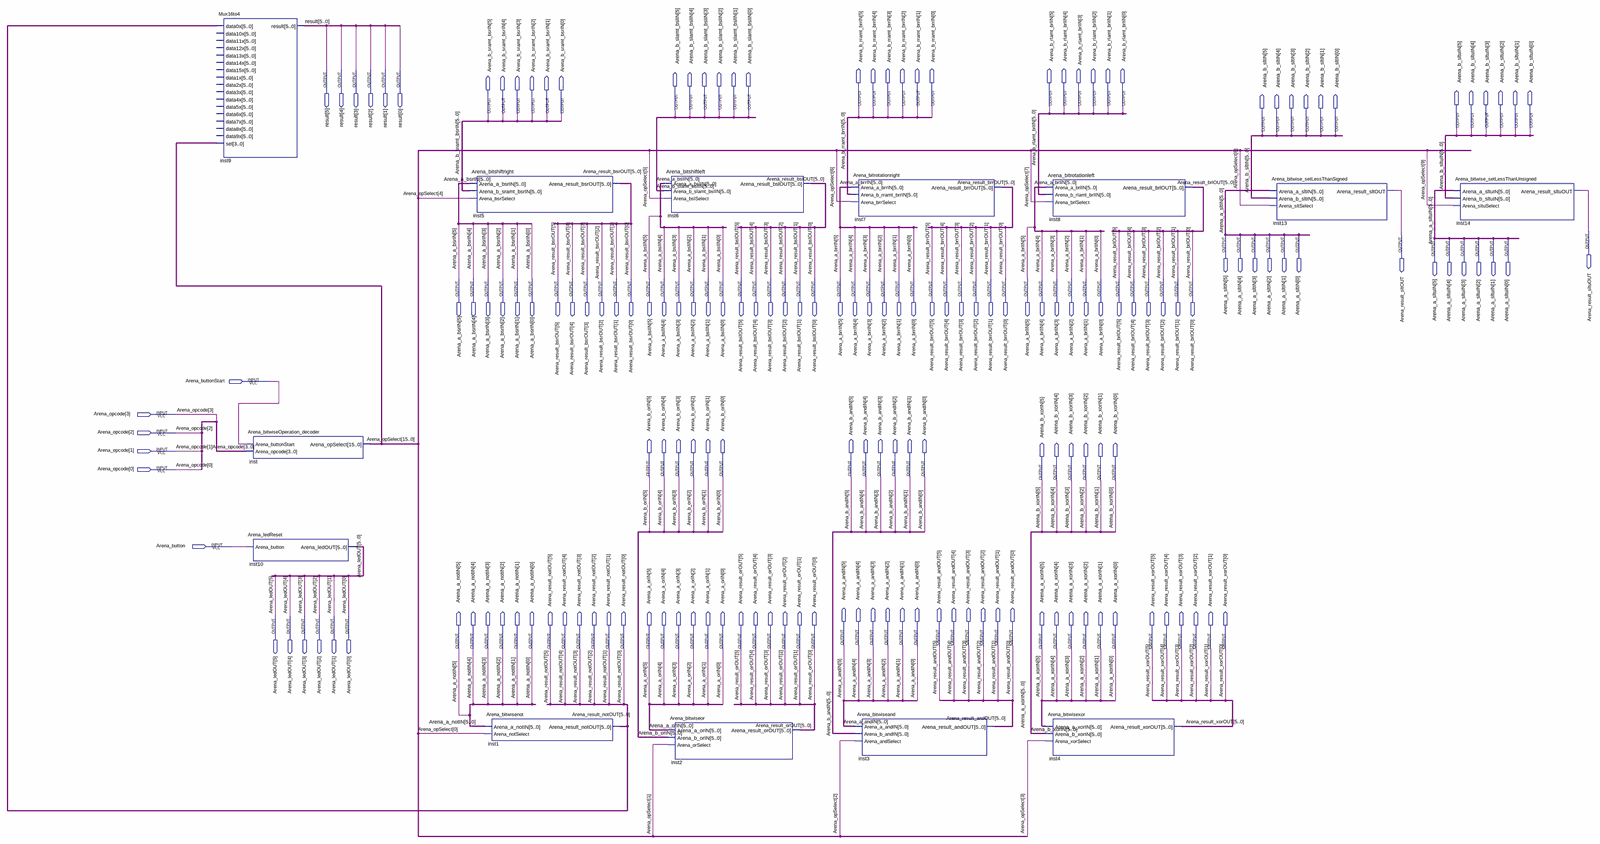
[diagram p0: schematic sheet, whole]
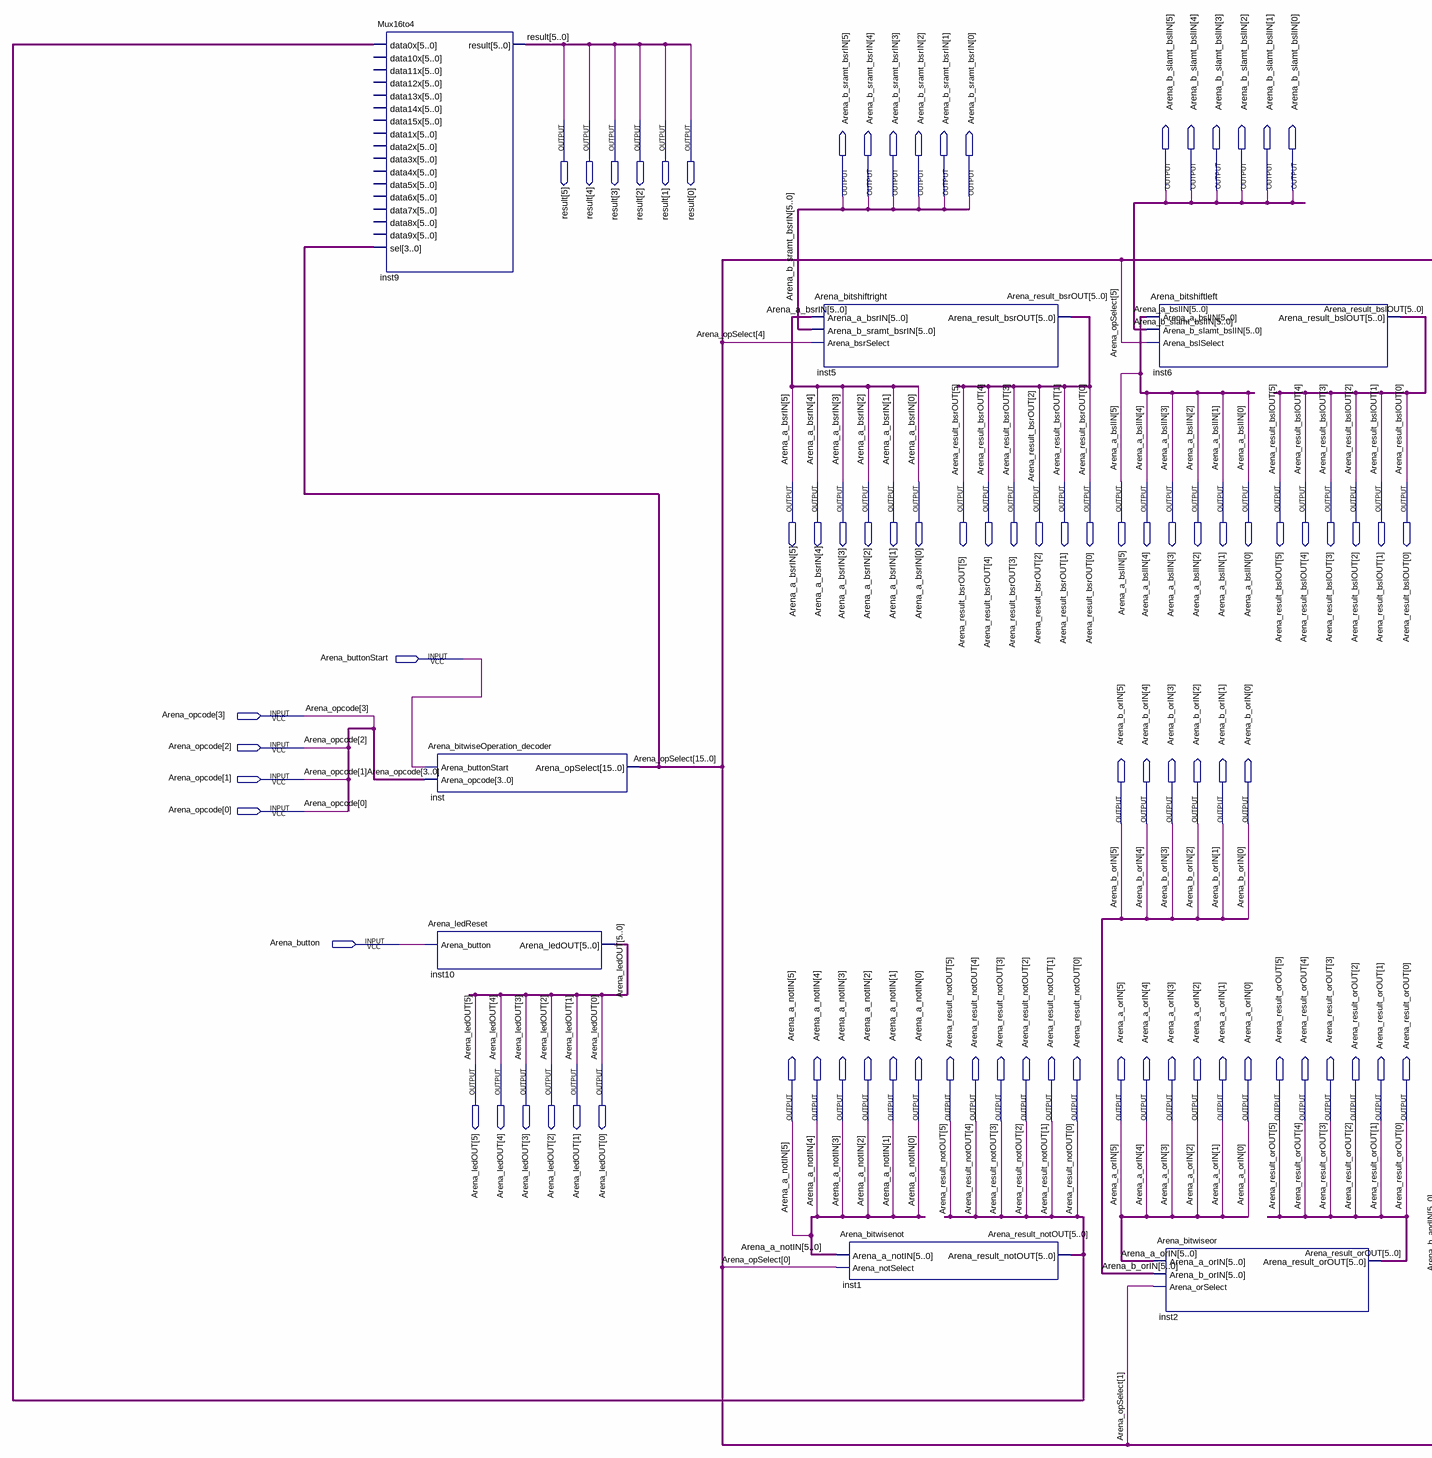
[diagram p1: schematic sheet, left part]
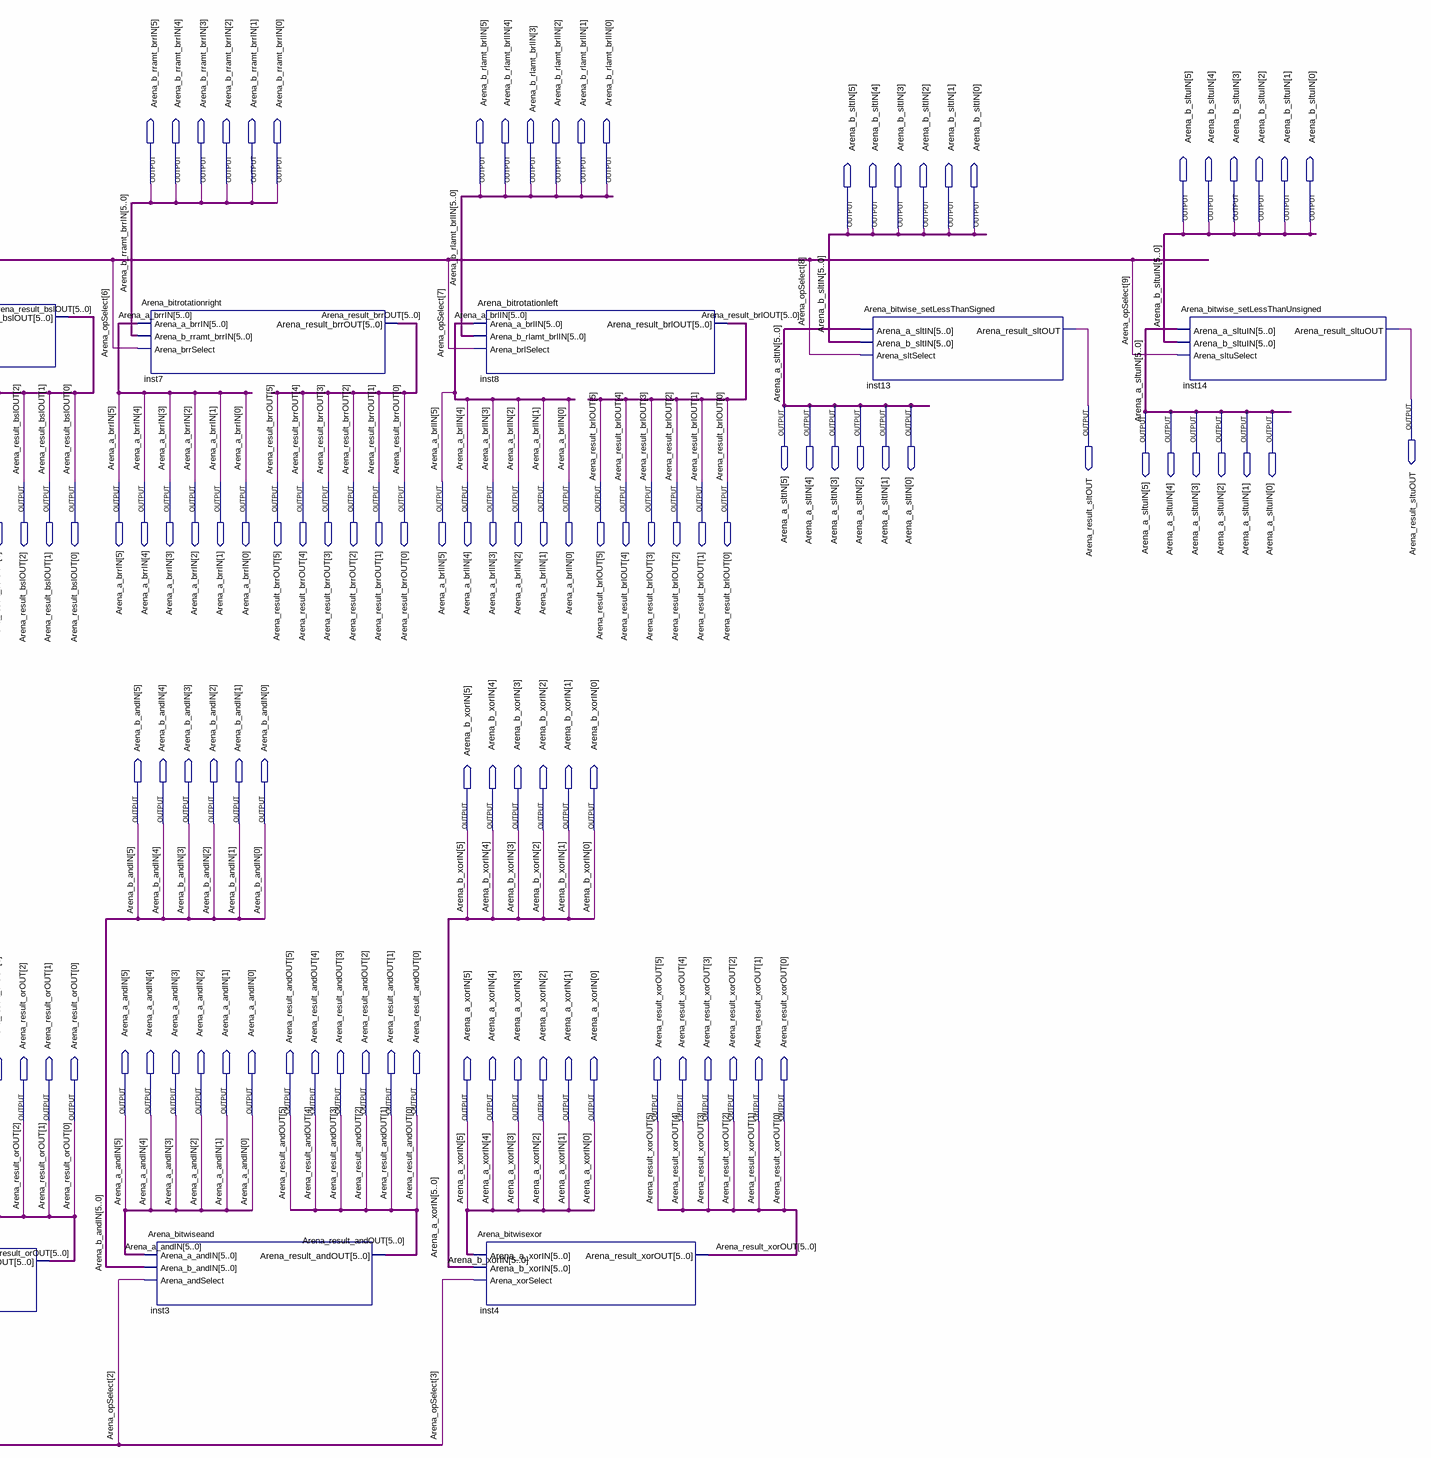
[diagram p2: schematic sheet, right part]
// Quartus schematic Arena_bitwise.bdf as structural Verilog: 13 symbols, 182 pins
module Arena_bitwise (
  input  Arena_buttonStart,
  input  [3:0] Arena_opcode,
  input  Arena_button,
  output [5:0] result,
  output [5:0] Arena_b_rramt_brrIN,
  output [5:0] Arena_b_rlamt_brlIN,
  output [5:0] Arena_b_slamt_bslIN,
  output [5:0] Arena_b_sramt_bsrIN,
  output [5:0] Arena_b_sltuIN,
  output [5:0] Arena_b_sltIN,
  output Arena_result_sltuOUT,
  output [5:0] Arena_a_sltIN,
  output Arena_result_sltOUT,
  output [5:0] Arena_a_sltuIN,
  output [5:0] Arena_a_bsrIN,
  output [5:0] Arena_result_bsrOUT,
  output [5:0] Arena_a_bslIN,
  output [5:0] Arena_result_bslOUT,
  output [5:0] Arena_a_brrIN,
  output [5:0] Arena_result_brrOUT,
  output [5:0] Arena_a_brlIN,
  output [5:0] Arena_result_brlOUT,
  output [5:0] Arena_b_orIN,
  output [5:0] Arena_b_andIN,
  output [5:0] Arena_b_xorIN,
  output [5:0] Arena_ledOUT,
  output [5:0] Arena_a_andIN,
  output [5:0] Arena_result_andOUT,
  output [5:0] Arena_a_notIN,
  output [5:0] Arena_result_notOUT,
  output [5:0] Arena_a_orIN,
  output [5:0] Arena_result_orOUT,
  output [5:0] Arena_a_xorIN,
  output [5:0] Arena_result_xorOUT
);

  wire [15:0] Arena_opSelect;

  Mux16to4 inst9 (
    .data0x(Arena_result_notOUT), .sel(Arena_opSelect), .result(result));  // open: data10x, data11x, data12x, data13x, data14x, data15x, data1x, data2x, data3x, data4x, data5x, data6x, data7x, data8x, data9x
  Arena_bitwiseOperation_decoder inst (
    .Arena_buttonStart(Arena_buttonStart), .Arena_opcode(Arena_opcode), .Arena_opSelect(Arena_opSelect));
  Arena_ledReset inst10 (.Arena_button(Arena_button), .Arena_ledOUT(Arena_ledOUT));
  Arena_bitshiftright inst5 (
    .Arena_a_bsrIN(Arena_a_bsrIN), .Arena_b_sramt_bsrIN(Arena_b_sramt_bsrIN),
    .Arena_bsrSelect(Arena_opSelect[4]), .Arena_result_bsrOUT(Arena_result_bsrOUT));
  Arena_bitwisenot inst1 (
    .Arena_a_notIN(Arena_a_notIN), .Arena_notSelect(Arena_opSelect[0]),
    .Arena_result_notOUT(Arena_result_notOUT));
  Arena_bitshiftleft inst6 (
    .Arena_a_bslIN(Arena_a_bslIN), .Arena_b_slamt_bslIN(Arena_b_slamt_bslIN),
    .Arena_bslSelect(Arena_opSelect[5]), .Arena_result_bslOUT(Arena_result_bslOUT));
  Arena_bitwiseor inst2 (
    .Arena_a_orIN(Arena_a_orIN), .Arena_b_orIN(Arena_b_orIN), .Arena_orSelect(Arena_opSelect[1]),
    .Arena_result_orOUT(Arena_result_orOUT));
  Arena_bitrotationright inst7 (
    .Arena_a_brrIN(Arena_a_brrIN), .Arena_b_rramt_brrIN(Arena_b_rramt_brrIN),
    .Arena_brrSelect(Arena_opSelect[6]), .Arena_result_brrOUT(Arena_result_brrOUT));
  Arena_bitwiseand inst3 (
    .Arena_a_andIN(Arena_a_andIN), .Arena_b_andIN(Arena_b_andIN), .Arena_andSelect(Arena_opSelect[2]),
    .Arena_result_andOUT(Arena_result_andOUT));
  Arena_bitrotationleft inst8 (
    .Arena_a_brlIN(Arena_a_brlIN), .Arena_b_rlamt_brlIN(Arena_b_rlamt_brlIN),
    .Arena_brlSelect(Arena_opSelect[7]), .Arena_result_brlOUT(Arena_result_brlOUT));
  Arena_bitwisexor inst4 (
    .Arena_a_xorIN(Arena_a_xorIN), .Arena_b_xorIN(Arena_b_xorIN), .Arena_xorSelect(Arena_opSelect[3]),
    .Arena_result_xorOUT(Arena_result_xorOUT));
  Arena_bitwise_setLessThanSigned inst13 (
    .Arena_a_sltIN(Arena_a_sltIN), .Arena_b_sltIN(Arena_b_sltIN), .Arena_sltSelect(Arena_opSelect[8]),
    .Arena_result_sltOUT(Arena_result_sltOUT));
  Arena_bitwise_setLessThanUnsigned inst14 (
    .Arena_a_sltuIN(Arena_a_sltuIN), .Arena_b_sltuIN(Arena_b_sltuIN), .Arena_sltuSelect(Arena_opSelect[9]),
    .Arena_result_sltuOUT(Arena_result_sltuOUT));
endmodule
